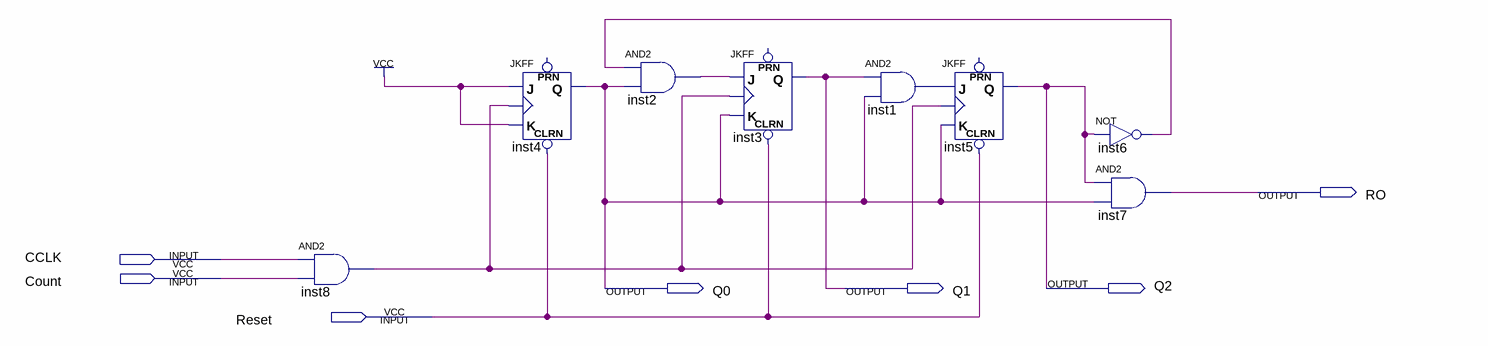
[diagram p0: schematic sheet]
// Quartus schematic LAB2.bdf as structural Verilog: 8 symbols, 7 pins
module LAB2 (
  input  CCLK,
  input  Count,
  input  Reset,
  output RO,
  output Q0,
  output Q1,
  output Q2
);

  wire inst1_out, inst2_out, inst6_out, inst8_out;

  and inst8 (inst8_out, CCLK, Count);
  JKFF inst4 (.CLRN(Reset), .K(1'b1), .J(1'b1), .CLK(inst8_out), .Q(Q0));  // open: PRN
  and inst2 (inst2_out, inst6_out, Q0);
  JKFF inst3 (.CLRN(Reset), .K(Q0), .J(inst2_out), .CLK(inst8_out), .Q(Q1));  // open: PRN
  and inst1 (inst1_out, Q1, Q0);
  JKFF inst5 (.CLRN(Reset), .K(Q0), .J(inst1_out), .CLK(inst8_out), .Q(Q2));  // open: PRN
  not inst6 (inst6_out, Q2);
  and inst7 (RO, Q2, Q0);
endmodule
